# Altium schematic sheet IMU External.SchDoc
size A
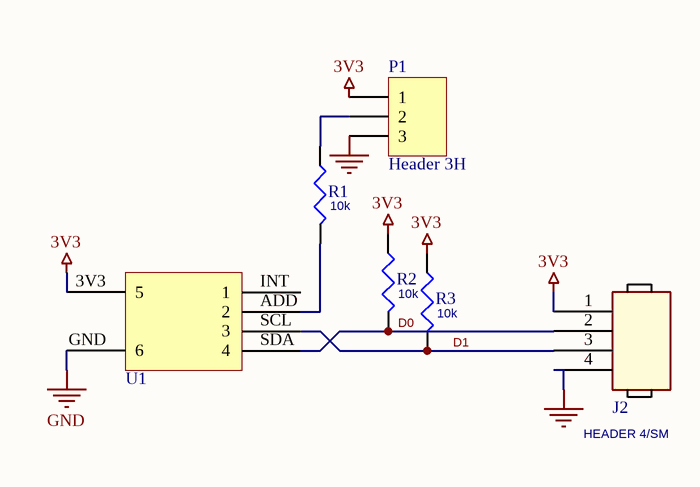
[diagram p0: IMU External.SchDoc]

## Parts
J2  HEADER 4/SM  [header4]
P1  Header 3H  [BNO055]
R1  10k  [RESC402N]
R2  10k  [RESC402N]
R3  10k  [RESC402N]
U1  BNO055 Nano  [BNO055]  (value not drawn)

## Nets
3V3: J2.1 P1.1 R2.1 R3.1 U1.3V3(5)
GND: J2.4 P1.3 U1.GND(6)
D0: J2.2 R2.2 U1.SDA(4)
D1: J2.3 R3.2 U1.SCL(3)
NetP1_2: P1.2 R1.1
NetR1_2: R1.2 U1.ADD(2)

Not connected (* = marked no-connect by the designer): U1 INT(1)

## Library data of the parts
P1 = Header 3H: Header, 3-Pin, Right Angle; LatestRevisionDate: 17-Jul-2002; LatestRevisionNote: Re-released for DXP Platform.; Publisher: Altium Limited
R1-R3 = RC0402FR-0710KL: RES SMD 10K OHM 1% 1/16W 0402
U1 = BNO055 Nano: PESKY PRODUCTS BNO-055 NANO BREAKOUT BOARD